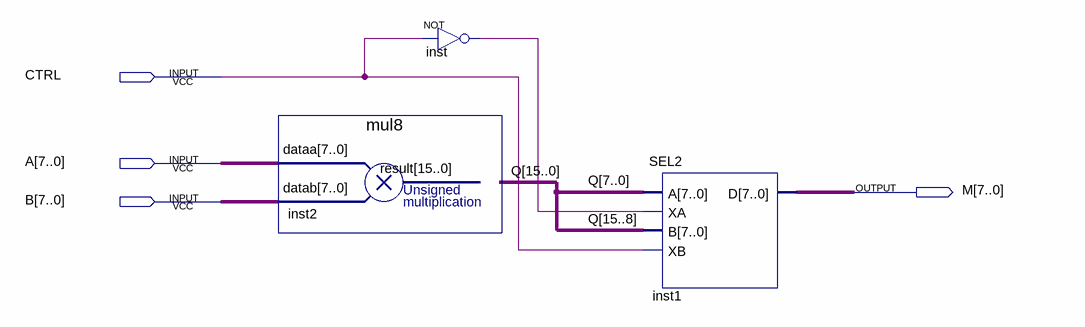
[diagram p0: schematic sheet]
// Quartus schematic MUL.bdf as structural Verilog: 3 symbols, 4 pins
module MUL (
  input  CTRL,
  input  [7:0] A,
  input  [7:0] B,
  output [7:0] M
);

  wire inst_out;
  wire [15:0] Q;

  mul8 inst2 (.dataa(A), .datab(B), .result(Q));
  not inst (inst_out, CTRL);
  SEL2 inst1 (.A(Q[7:0]), .XA(inst_out), .B(Q[15:8]), .XB(CTRL), .D(M));
endmodule
